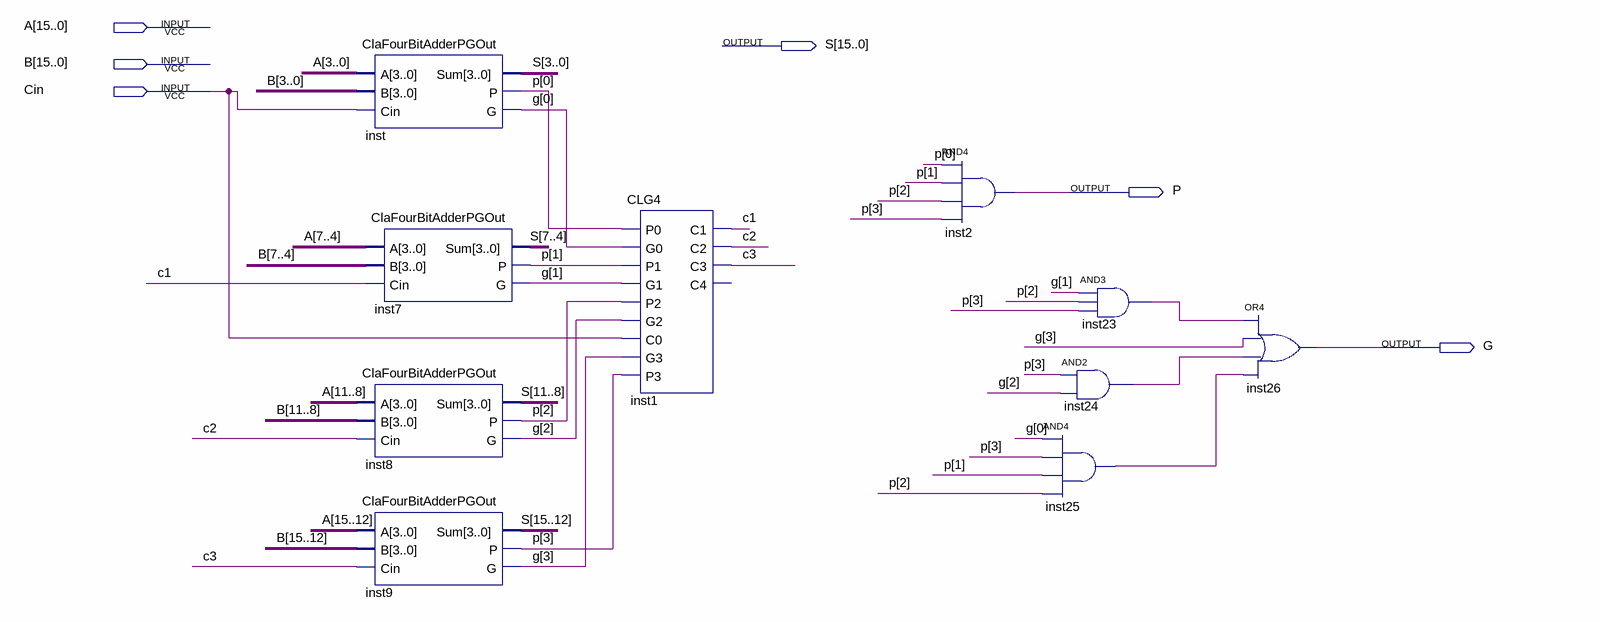
[diagram p0: schematic sheet]
// Quartus schematic Adder16BitWithPG.bdf as structural Verilog: 10 symbols, 6 pins
module Adder16BitWithPG (
  input  [15:0] A,
  input  [15:0] B,
  input  Cin,
  output [15:0] S,
  output P,
  output G
);

  wire c1, c2, c3, inst23_out, inst24_out, inst25_out;
  wire [3:0] G_bus, P_bus;

  ClaFourBitAdderPGOut inst (.A(A[3:0]), .B(B[3:0]), .Cin(Cin), .Sum(S[3:0]), .P(P_bus[0]), .G(G_bus[0]));
  ClaFourBitAdderPGOut inst7 (.A(A[7:4]), .B(B[7:4]), .Cin(c1), .Sum(S[7:4]), .P(P_bus[1]), .G(G_bus[1]));
  ClaFourBitAdderPGOut inst8 (.A(A[11:8]), .B(B[11:8]), .Cin(c2), .Sum(S[11:8]), .P(P_bus[2]), .G(G_bus[2]));
  ClaFourBitAdderPGOut inst9 (.A(A[15:12]), .B(B[15:12]), .Cin(c3), .Sum(S[15:12]), .P(P_bus[3]), .G(G_bus[3]));
  CLG4 inst1 (
    .P0(P_bus[0]), .G0(G_bus[0]), .P1(P_bus[1]), .G1(G_bus[1]), .P2(P_bus[2]), .G2(G_bus[2]), .C0(Cin),
    .G3(G_bus[3]), .P3(P_bus[3]), .C1(c1), .C2(c2), .C3(c3));  // open: C4
  and inst2 (P, P_bus[0], P_bus[1], P_bus[2], P_bus[3]);
  and inst23 (inst23_out, G_bus[1], P_bus[2], P_bus[3]);
  and inst24 (inst24_out, P_bus[3], G_bus[2]);
  and inst25 (inst25_out, G_bus[0], P_bus[3], P_bus[1], P_bus[2]);
  or inst26 (G, inst23_out, G_bus[3], inst24_out, inst25_out);
endmodule
